# EasyEDA schematic BIT 4.json
TITLE: TRICORE | ALU | LOGIC; REV: 1.0; Date: 2022-01-03; Sheet: 6/9; Drawn By: Koehler, Paul; Company: komed3
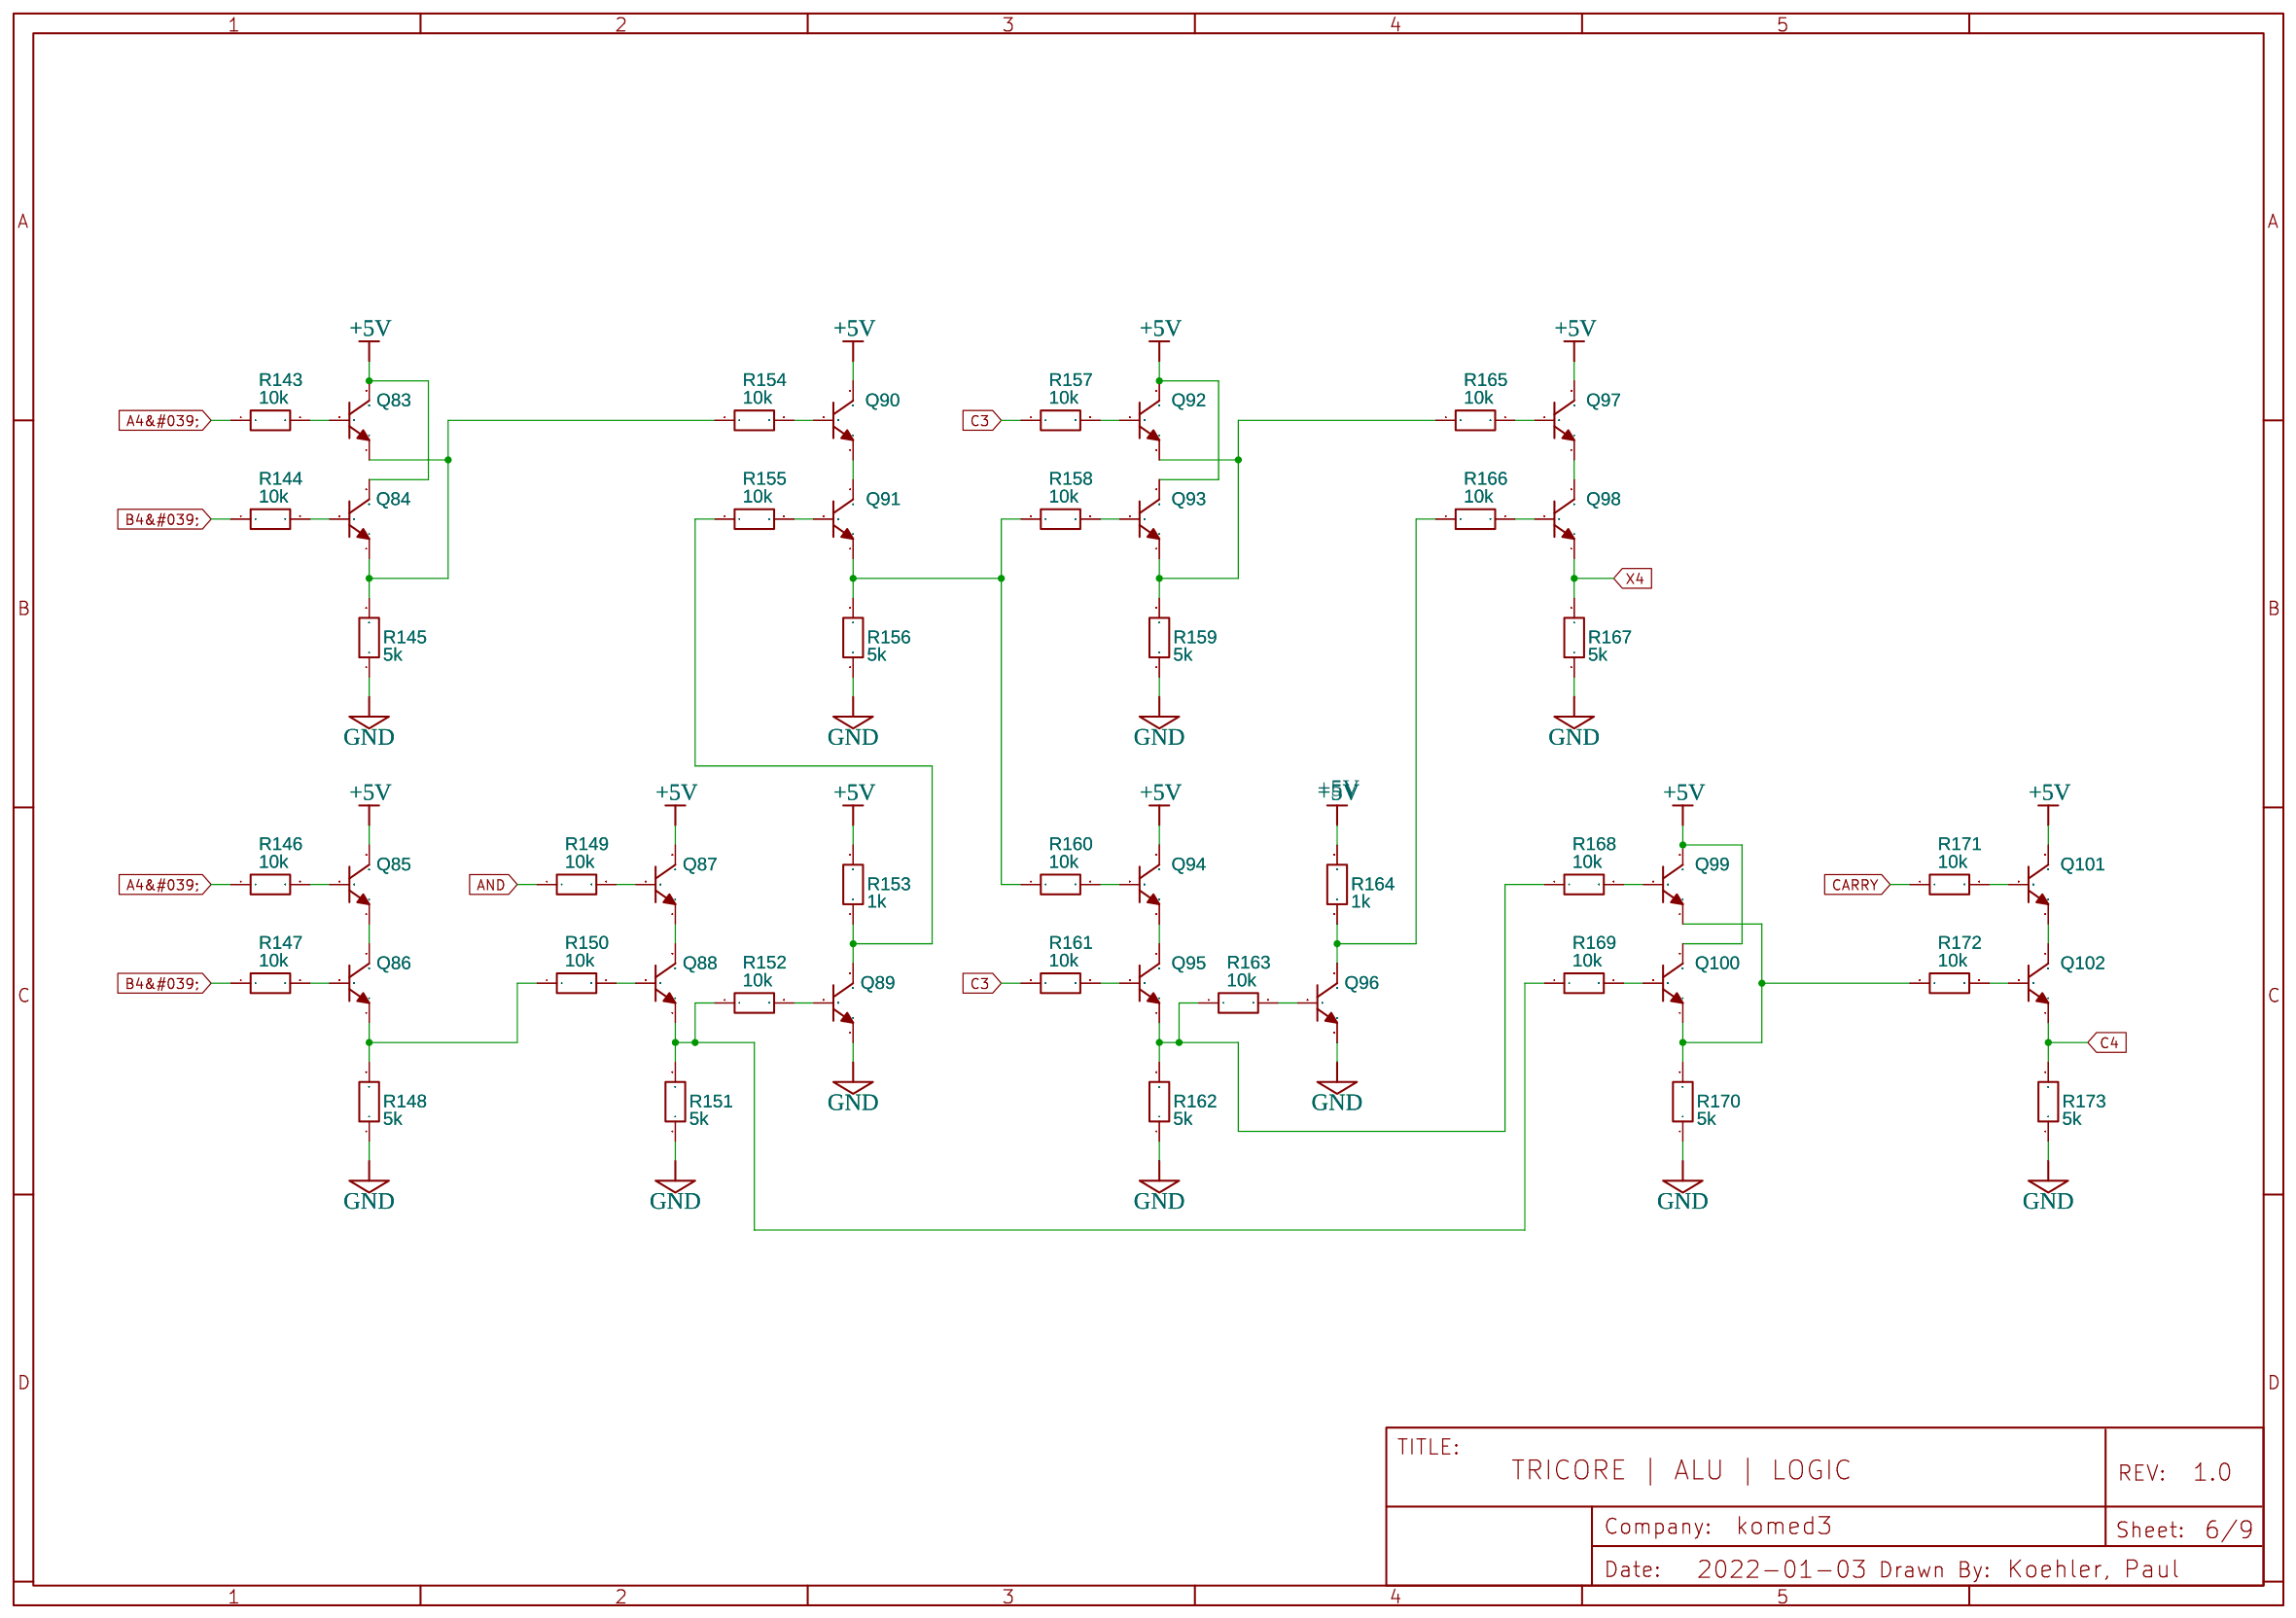
[diagram p0: schematic sheet]

## Parts
Q83  2N3904(TO-92)  [TO-92-3_L5.1-W4.1-P1.27-L]
Q84  2N3904(TO-92)  [TO-92-3_L5.1-W4.1-P1.27-L]
Q85  2N3904(TO-92)  [TO-92-3_L5.1-W4.1-P1.27-L]
Q86  2N3904(TO-92)  [TO-92-3_L5.1-W4.1-P1.27-L]
Q87  2N3904(TO-92)  [TO-92-3_L5.1-W4.1-P1.27-L]
Q88  2N3904(TO-92)  [TO-92-3_L5.1-W4.1-P1.27-L]
Q89  2N3904(TO-92)  [TO-92-3_L5.1-W4.1-P1.27-L]
Q90  2N3904(TO-92)  [TO-92-3_L5.1-W4.1-P1.27-L]
Q91  2N3904(TO-92)  [TO-92-3_L5.1-W4.1-P1.27-L]
Q92  2N3904(TO-92)  [TO-92-3_L5.1-W4.1-P1.27-L]
Q93  2N3904(TO-92)  [TO-92-3_L5.1-W4.1-P1.27-L]
Q94  2N3904(TO-92)  [TO-92-3_L5.1-W4.1-P1.27-L]
Q95  2N3904(TO-92)  [TO-92-3_L5.1-W4.1-P1.27-L]
Q96  2N3904(TO-92)  [TO-92-3_L5.1-W4.1-P1.27-L]
Q97  2N3904(TO-92)  [TO-92-3_L5.1-W4.1-P1.27-L]
Q98  2N3904(TO-92)  [TO-92-3_L5.1-W4.1-P1.27-L]
Q99  2N3904(TO-92)  [TO-92-3_L5.1-W4.1-P1.27-L]
Q100  2N3904(TO-92)  [TO-92-3_L5.1-W4.1-P1.27-L]
Q101  2N3904(TO-92)  [TO-92-3_L5.1-W4.1-P1.27-L]
Q102  2N3904(TO-92)  [TO-92-3_L5.1-W4.1-P1.27-L]
R143  10k  [0.25W-RESISTOR-VERTICAL]
R144  10k  [0.25W-RESISTOR-VERTICAL]
R145  5k  [0.25W-RESISTOR-VERTICAL]
R146  10k  [0.25W-RESISTOR-VERTICAL]
R147  10k  [0.25W-RESISTOR-VERTICAL]
R148  5k  [0.25W-RESISTOR-VERTICAL]
R149  10k  [0.25W-RESISTOR-VERTICAL]
R150  10k  [0.25W-RESISTOR-VERTICAL]
R151  5k  [0.25W-RESISTOR-VERTICAL]
R152  10k  [0.25W-RESISTOR-VERTICAL]
R153  1k  [0.25W-RESISTOR-VERTICAL]
R154  10k  [0.25W-RESISTOR-VERTICAL]
R155  10k  [0.25W-RESISTOR-VERTICAL]
R156  5k  [0.25W-RESISTOR-VERTICAL]
R157  10k  [0.25W-RESISTOR-VERTICAL]
R158  10k  [0.25W-RESISTOR-VERTICAL]
R159  5k  [0.25W-RESISTOR-VERTICAL]
R160  10k  [0.25W-RESISTOR-VERTICAL]
R161  10k  [0.25W-RESISTOR-VERTICAL]
R162  5k  [0.25W-RESISTOR-VERTICAL]
R163  10k  [0.25W-RESISTOR-VERTICAL]
R164  1k  [0.25W-RESISTOR-VERTICAL]
R165  10k  [0.25W-RESISTOR-VERTICAL]
R166  10k  [0.25W-RESISTOR-VERTICAL]
R167  5k  [0.25W-RESISTOR-VERTICAL]
R168  10k  [0.25W-RESISTOR-VERTICAL]
R169  10k  [0.25W-RESISTOR-VERTICAL]
R170  5k  [0.25W-RESISTOR-VERTICAL]
R171  10k  [0.25W-RESISTOR-VERTICAL]
R172  10k  [0.25W-RESISTOR-VERTICAL]
R173  5k  [0.25W-RESISTOR-VERTICAL]

## Library data of the parts
Q83-Q102 = 2N3904(TO-92): Supplier: LCSC; Manufacturer: SEMTECH; Manufacturer Part: 2N3904; Supplier Part: C118538; Contributor: LCEDA_Lib
R143-R173 = R_AXIAL-0.3_EU: Contributor: LCEDA_Lib

## Nets
+5V: Q83.3(C) Q84.3(C) Q85.3(C) Q87.3(C) Q90.3(C) Q92.3(C) Q93.3(C) Q94.3(C) Q97.3(C) Q99.3(C) Q100.3(C) Q101.3(C) R153.2 R164.2
GND: Q89.1(E) Q96.1(E) R145.1 R148.1 R151.1 R156.1 R159.1 R162.1 R167.1 R170.1 R173.1
A4&#039;: R143.1 R146.1
AND: R149.1
B4&#039;: R144.1 R147.1
C3: R157.1 R161.1
C4: Q102.1(E) R173.2
CARRY: R171.1
X4: Q98.1(E) R167.2
Net-(Q83-1): Q83.1(E) Q84.1(E) R145.2 R154.1
Net-(Q83-2): Q83.2(B) R143.2
Net-(Q84-2): Q84.2(B) R144.2
Net-(Q85-1): Q85.1(E) Q86.3(C)
Net-(Q85-2): Q85.2(B) R146.2
Net-(Q86-1): Q86.1(E) R148.2 R150.1
Net-(Q86-2): Q86.2(B) R147.2
Net-(Q87-1): Q87.1(E) Q88.3(C)
Net-(Q87-2): Q87.2(B) R149.2
Net-(Q88-1): Q88.1(E) R151.2 R152.1 R169.1
Net-(Q88-2): Q88.2(B) R150.2
Net-(Q89-2): Q89.2(B) R152.2
Net-(Q89-3): Q89.3(C) R153.1 R155.1
Net-(Q90-1): Q90.1(E) Q91.3(C)
Net-(Q90-2): Q90.2(B) R154.2
Net-(Q91-1): Q91.1(E) R156.2 R158.1 R160.1
Net-(Q91-2): Q91.2(B) R155.2
Net-(Q92-1): Q92.1(E) Q93.1(E) R159.2 R165.1
Net-(Q92-2): Q92.2(B) R157.2
Net-(Q93-2): Q93.2(B) R158.2
Net-(Q94-1): Q94.1(E) Q95.3(C)
Net-(Q94-2): Q94.2(B) R160.2
Net-(Q95-1): Q95.1(E) R162.2 R163.1 R168.1
Net-(Q95-2): Q95.2(B) R161.2
Net-(Q96-2): Q96.2(B) R163.2
Net-(Q96-3): Q96.3(C) R164.1 R166.1
Net-(Q97-1): Q97.1(E) Q98.3(C)
Net-(Q97-2): Q97.2(B) R165.2
Net-(Q98-2): Q98.2(B) R166.2
Net-(Q99-1): Q99.1(E) Q100.1(E) R170.2 R172.1
Net-(Q99-2): Q99.2(B) R168.2
Net-(Q100-2): Q100.2(B) R169.2
Net-(Q101-1): Q101.1(E) Q102.3(C)
Net-(Q101-2): Q101.2(B) R171.2
Net-(Q102-2): Q102.2(B) R172.2

## Notes on the sheet
- +5V
